# EAGLE schematic arcs-ecu_rev1 (EAGLE 9.0.0)
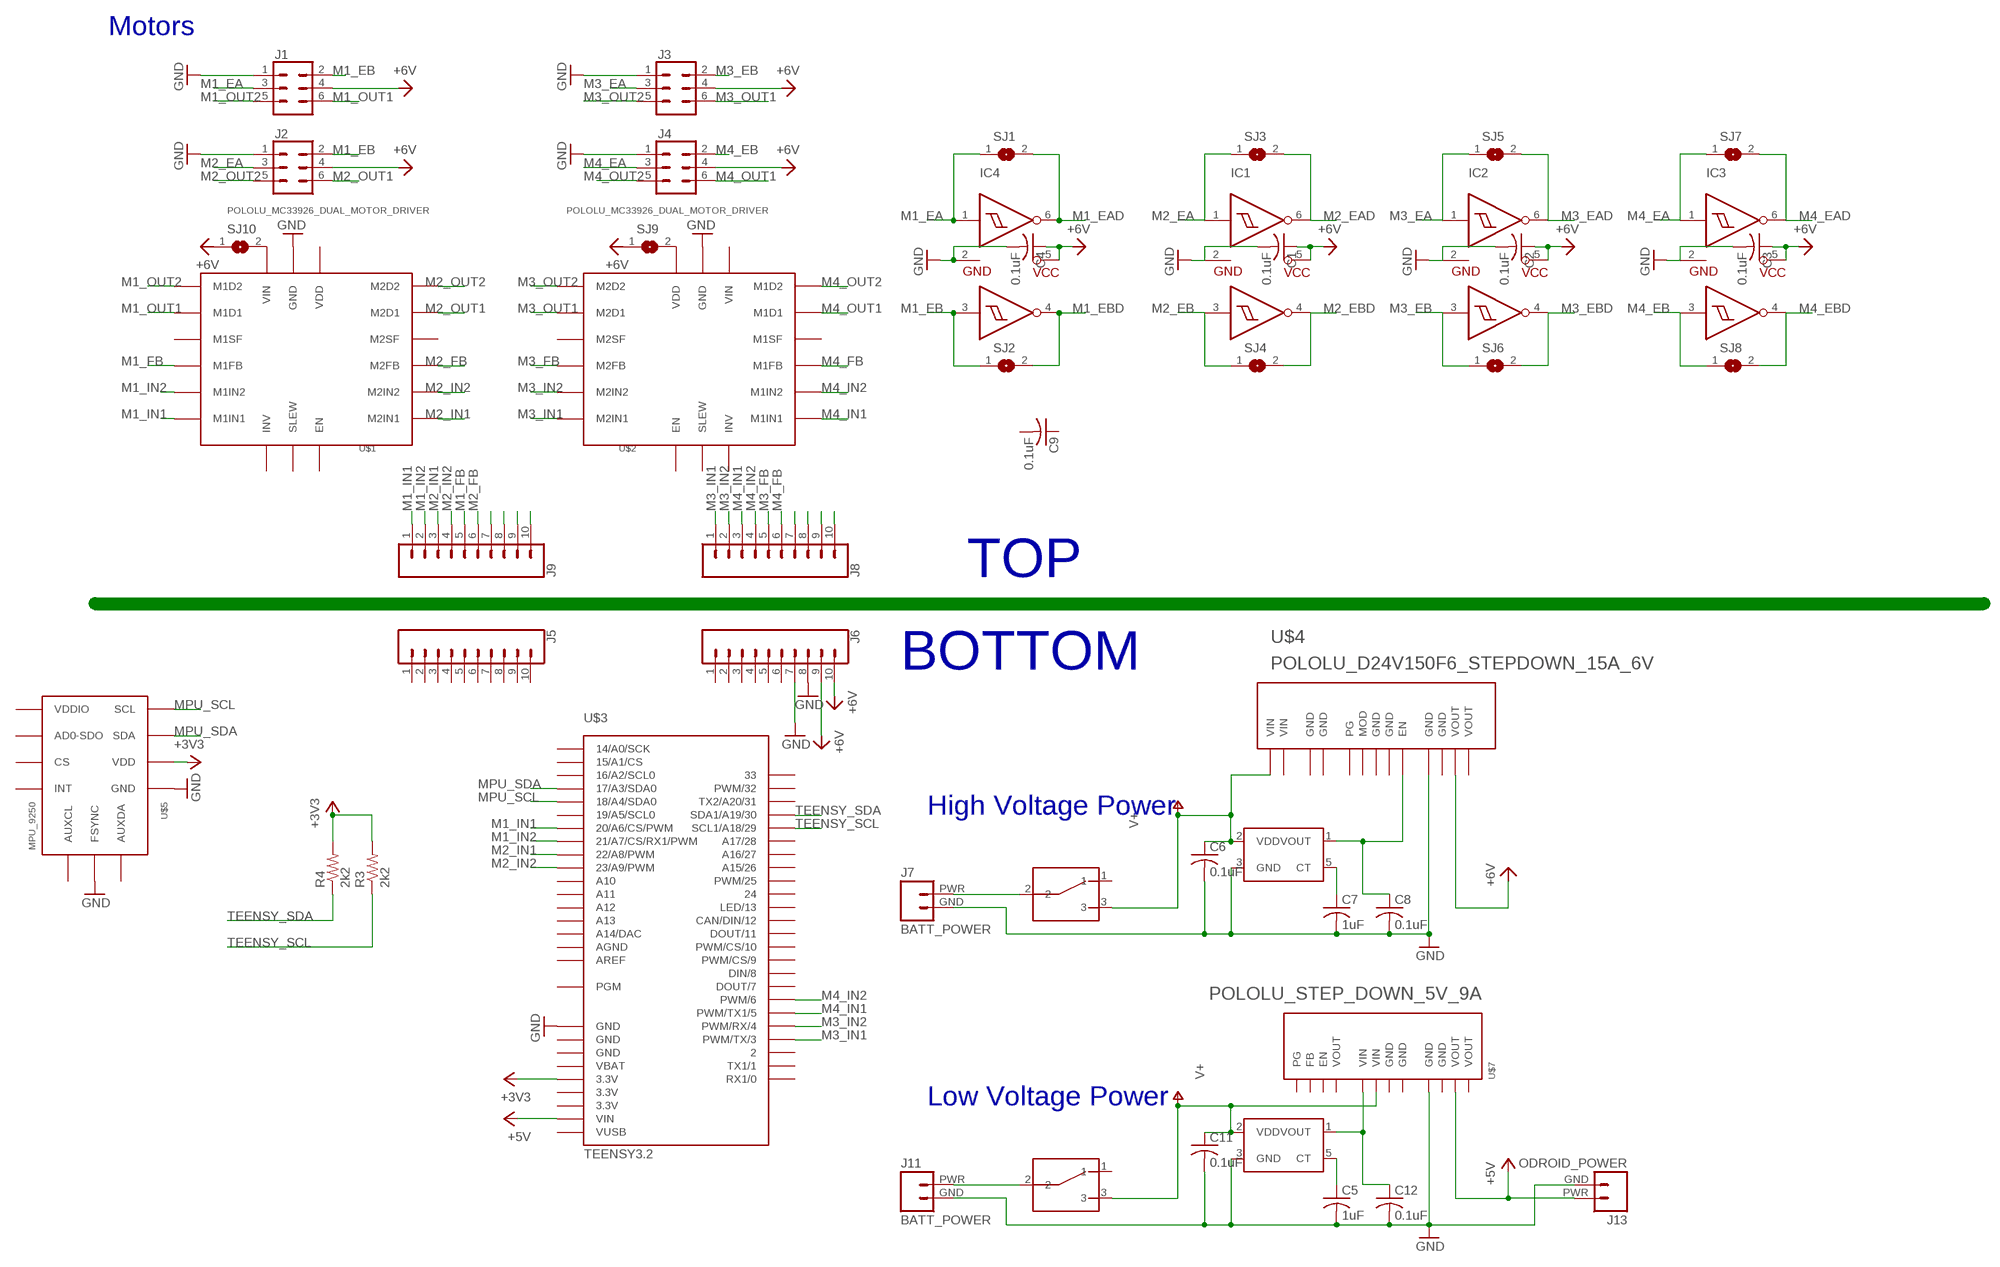
[diagram p0: schematic, sheet 1]

## Parts
C1  0.1uF  C-USC1206  [C1206]
C2  0.1uF  C-USC1206  [C1206]
C3  0.1uF  C-USC1206  [C1206]
C4  0.1uF  C-USC1206  [C1206]
C5  1uF  C-USC1206  [C1206]
C6  0.1uF  C-USC1206  [C1206]
C7  1uF  C-USC1206  [C1206]
C8  0.1uF  C-USC1206  [C1206]
C9  0.1uF  C-USC1206  [C1206]
C11  0.1uF  C-USC1206  [C1206]
C12  0.1uF  C-USC1206  [C1206]
IC1  SN74AUP2G17  [SC-70-6]
IC2  SN74AUP2G17  [SC-70-6]
IC3  SN74AUP2G17  [SC-70-6]
IC4  SN74AUP2G17  [SC-70-6]
J1  CONN_03X2SHROUD  [2X3-SHROUDED]
J2  CONN_03X2SHROUD  [2X3-SHROUDED]
J3  CONN_03X2SHROUD  [2X3-SHROUDED]
J4  CONN_03X2SHROUD  [2X3-SHROUDED]
J5  CONN_10"  [1X10]
J6  CONN_10"  [1X10]
J7  BATT_POWER  [BATT_POWER]
J8  CONN_10"  [1X10]
J9  CONN_10"  [1X10]
J11  BATT_POWER  [BATT_POWER]
J13  ODROID_POWER  [ODOIRD_PWR]
R3  2k2  R-US_R1206  [R1206]
R4  2k2  R-US_R1206  [R1206]
SJ1  SJ  [SJ]
SJ2  SJ  [SJ]
SJ3  SJ  [SJ]
SJ4  SJ  [SJ]
SJ5  SJ  [SJ]
SJ6  SJ  [SJ]
SJ7  SJ  [SJ]
SJ8  SJ  [SJ]
SJ9  SJ  [SJ]
SJ10  SJ  [SJ]
SW1  500SSP1S1M6QEA  [500SSP1S1M6QEA_SWITCH]
SW3  500SSP1S1M6QEA  [500SSP1S1M6QEA_SWITCH]
U$1  POLOLU_MC33926_DUAL_MOTOR_DRIVER  [POLOLU_MC33926_DUAL_MOTOR_DRIVER]
U$2  POLOLU_MC33926_DUAL_MOTOR_DRIVER  [POLOLU_MC33926_DUAL_MOTOR_DRIVER]
U$3  TEENSY3.2  [TEENSY3.2]
U$4  POLOLU_D24V150F6_STEPDOWN_15A_6V  [POLOLU_D24V150F6_STEPDOWN_15A_6V]
U$5  MPU_9250  [MPU-9250]
U$6  BD5260G  [SOT23-5]
U$7  POLOLU_STEP_DOWN_5V_9A  [POLOLU_STEP_DOWN_5V_9A]
U$9  BD5260G  [SOT23-5]

## Nets
+3V3: R3.2 R4.2 U$3.3.3V@1(3.3V) U$5.VDD
+5V: J13.PWR U$3.VIN U$7.VOUT@2(VOUT)
GND: C5.2 C6.2 C7.2 C8.2 C11.2 C12.2 IC4.2(GND) J1.1 J2.1 J3.1 J4.1 J6.7 J6.8 J7.GND J11.GND J13.GND U$3.GND@1(GND) U$4.GND@3(GND) U$6.3(GND) U$7.GND@3(GND) U$9.3(GND)
M1_EA: IC4.1(1A) J1.3
M1_EAD: IC4.6(1Y)
M1_EB: IC4.3(2A) J1.2 J2.2
M1_EBD: IC4.4(2Y)
M1_FB: U$1.M1FB
M1_IN1: J9.1 U$1.M1IN1 U$3.20/A6(20/A6/CS/PWM)
M1_IN2: J9.2 U$1.M1IN2 U$3.21/A7(21/A7/CS/RX1/PWM)
M1_OUT1: J1.6 U$1.M1D1
M1_OUT2: J1.5 U$1.M1D2
M2_EA: J2.3
M2_FB: U$1.M2FB
M2_IN1: J9.3 U$1.M2IN1 U$3.22/A8(22/A8/PWM)
M2_IN2: J9.4 U$1.M2IN2 U$3.23/A9(23/A9/PWM)
M2_OUT1: J2.6 U$1.M2D1
M2_OUT2: J2.5 U$1.M2D2
M3_EA: J3.3
M3_EB: J3.2
M3_FB: U$2.M2FB
M3_IN1: U$2.M2IN1 U$3.3(PWM/TX/3)
M3_IN2: U$2.M2IN2 U$3.4(PWM/RX/4)
M3_OUT1: J3.6 U$2.M2D1
M3_OUT2: J3.5 U$2.M2D2
M4_EA: J4.3
M4_EB: J4.2
M4_FB: U$2.M1FB
M4_IN1: U$2.M1IN1 U$3.5(PWM/TX1/5)
M4_IN2: U$2.M1IN2 U$3.6(PWM/6)
M4_OUT1: J4.6 U$2.M1D1
M4_OUT2: J4.5 U$2.M1D2
MPU_SCL: U$3.18/A4(18/A4/SDA0) U$5.SCL
MPU_SDA: U$3.17/A3(17/A3/SDA0) U$5.SDA
N$1: J7.PWR SW1.2
N$2: J11.PWR SW3.2
N$3: C8.1 U$4.EN U$6.1(VOUT)
N$4: C7.1 U$6.5(CT)
N$6: SJ10.2 U$1.VIN
N$7: J9.9
N$8: J9.10
N$9: C12.1 U$7.VIN@1(VIN) U$9.1(VOUT)
N$10: C5.1 U$9.5(CT)
N$15: J8.5
N$16: J8.6
N$17: J8.7
N$18: J8.8
N$19: J8.9
N$20: J8.10
N$21: J9.5
N$22: J9.6
N$23: J9.7
N$24: J9.8
P$1: IC4.5(VCC) J1.4 J2.4 J3.4 J4.4 J6.9 J6.10 U$4.VOUT@1(VOUT) ; supply symbol labelled +6V
TEENSY_SCL: R3.1 U$3.29(SCL1/A18/29)
TEENSY_SDA: R4.1 U$3.30(SDA1/A19/30)
V+: C6.1 C11.1 SW1.3 SW3.3 U$4.VIN@1(VIN) U$6.2(VDD) U$7.VIN@2(VIN) U$9.2(VDD)
Unconnected: C1.1 C1.2 C2.1 C2.2 C3.1 C3.2 C4.1 C4.2 C9.1 C9.2 IC1.1(1A) IC1.2(GND) IC1.3(2A) IC1.4(2Y) IC1.5(VCC) IC1.6(1Y) IC2.1(1A) IC2.2(GND) IC2.3(2A) IC2.4(2Y) IC2.5(VCC) IC2.6(1Y) IC3.1(1A) IC3.2(GND) IC3.3(2A) IC3.4(2Y) IC3.5(VCC) IC3.6(1Y) J5.1 J5.2 J5.3 J5.4 J5.5 J5.6 J5.7 J5.8 J5.9 J5.10 J6.1 J6.2 J6.3 J6.4 J6.5 J6.6 J8.1 J8.2 J8.3 J8.4 SJ1.1 SJ1.2 SJ2.1 SJ2.2 SJ3.1 SJ3.2 SJ4.1 SJ4.2 SJ5.1 SJ5.2 SJ6.1 SJ6.2 SJ7.1 SJ7.2 SJ8.1 SJ8.2 SJ9.1 SJ9.2 SJ10.1 SW1.1 SW3.1 U$1.EN U$1.GND U$1.INV U$1.M1SF U$1.MS2F(M2SF) U$1.SLEW U$1.VDD U$2.EN U$2.GND U$2.INV U$2.M1SF U$2.MS2F(M2SF) U$2.SLEW U$2.VDD U$2.VIN U$3.0(RX1/0) U$3.1(TX1/1) U$3.2 U$3.3.3V@2(3.3V) U$3.3.3V@3(3.3V) U$3.7(DOUT/7) U$3.8(DIN/8) U$3.9(PWM/CS/9) U$3.10(PWM/CS/10) U$3.11(DOUT/11) U$3.12(CAN/DIN/12) U$3.13(LED/13) U$3.14/A0(14/A0/SCK) U$3.15/A1(15/A1/CS) U$3.16/A2(16/A2/SCL0) U$3.19/A5(19/A5/SCL0) U$3.24 U$3.25(PWM/25) U$3.26/A15(A15/26) U$3.27/A16(A16/27) U$3.28/A17(A17/28) U$3.31(TX2/A20/31) U$3.32(PWM/32) U$3.33 U$3.A10 U$3.A11 U$3.A12 U$3.A13 U$3.A14(A14/DAC) U$3.AGND U$3.AREF U$3.GND@2(GND) U$3.GND@3(GND) U$3.PGM U$3.VBAT U$3.VUSB U$4.GND@1(GND) U$4.GND@2(GND) U$4.GND@4(GND) U$4.GND@5(GND) U$4.GND@6(GND) U$4.MOD U$4.PG U$4.VIN@2(VIN) U$4.VOUT@2(VOUT) U$5.AD0/SDO(AD0-SDO) U$5.AUXCL U$5.AUXDA U$5.CS U$5.FSYNC U$5.GND U$5.INT U$5.VDDIO U$7.EN U$7.FB U$7.GND@1(GND) U$7.GND@2(GND) U$7.GND@4(GND) U$7.PG U$7.VOUT@1(VOUT) U$7.VOUT@3(VOUT)

## Notes on the sheet
- Motors
- TOP
- BOTTOM
- High Voltage Power
- Low Voltage Power

## Library data of the parts
C1-C9 C11 C12 = rcl:C-US: CAPACITOR, American symbol; SPICEPREFIX: C
IC1-IC4 = arcs_library:SN74AUP2G17
J1-J4 = SparkFun-Connectors:CONN_03X2: Multi connection point. Often used as Generic Header-pin footprint for 0.1 inch spaced/style header connections You can populate with any combo of single row headers, but if you'd like an exact match, check these: Header - 2x3 (Male, 0.1") <https://www.sparkfun.com/products/12807> (PRT-12807) Header - 2x3 (Female, 0.1") <https://www.sparkfun.com/products/13010> (PRT-13010) 2x3 Pin Shrouded Header <https://www.sparkfun.com/products/10877> (PRT-10877) On any of the 0.1 inch spaced packages, you can populate with these: Break Away Headers - Straight <https://www.sparkfun.com/products/116> (PRT-00116) Break Away Male Headers - Right Angle <https://www.sparkfun.com/products/553> (PRT-00553) Female Headers <https://www.sparkfun.com/products/115> (PRT-00115) Break Away Headers - Machine Pin <https://www.sparkfun.com/products/117> (PRT-00117) Break Away Female Headers - Swiss Machine Pin <https://www.sparkfun.com/products/743> (PRT-00743) Special note: the shrouded connector mates well with our 3x2 ribbon cables: Ribbon Crimp Connector - 6-pin (2x3, Female) <https://www.sparkfun.com/products/10651> (PRT-10651) Ribbon Cable - 6 wire (15ft) <https://www.sparkfun.com/products/10646> (PRT-10646); PROD_ID: CONN-10681; SF_ID: PRT_10877
J5 J6 J8 J9 = SparkFun-Connectors:CONN_10: Multi connection point. Often used as Generic Header-pin footprint for 0.1 inch spaced/style header connections On any of the 0.1 inch spaced packages, you can populate with these: Break Away Headers - Straight <https://www.sparkfun.com/products/116> (PRT-00116) Break Away Male Headers - Right Angle <https://www.sparkfun.com/products/553> (PRT-00553) Female Headers <https://www.sparkfun.com/products/115> (PRT-00115) Break Away Headers - Machine Pin <https://www.sparkfun.com/products/117> (PRT-00117) Break Away Female Headers - Swiss Machine Pin <https://www.sparkfun.com/products/743> (PRT-00743) Arduino Stackable Header - 10 Pin <https://www.sparkfun.com/products/11376> (PRT-11376) For SCREWTERMINALS and SPRING TERMINALS visit here: Screw Terimnals on SparkFun.com <https://www.sparkfun.com/search/results?term=Screw+Terminals> (5mm/3.5mm/2.54mm spacing) This device is also useful as a general connection point to wire up your design to another part of your project. Our various solder wires solder well into these plated through hole pads. Hook-Up Wire - Assortment (Stranded, 22 AWG) <https://www.sparkfun.com/products/11375> (PRT-11375) Hook-Up Wire - Assortment (Solid Core, 22 AWG) <https://www.sparkfun.com/products/11367> (PRT-11367) View the entire wire category on our website here <https://www.sparkfun.com/categories/141> Special notes: Molex polarized connector foot print use with SKU : PRT-08231 with associated crimp pins and housings. 1MM SMD Version SKU: PRT-10208 NOTES ON THE VARIANTS LOCK and LOCK_LONGPADS... This footprint was designed to help hold the alignment of a through-hole component (i.e. 6-pin header) while soldering it into place. You may notice that each hole has been shifted either up or down by 0.005 of an inch from it's more standard position (which is a perfectly straight line). This slight alteration caused the pins (the squares in the middle) to touch the edges of the holes. Because they are alternating, it causes a "brace" to hold the component in place. 0.005 has proven to be the perfect amount of "off-center" position when using our standard breakaway headers. Although looks a little odd when you look at the bare footprint, once you have a header in there, the alteration is very hard to notice. Also,if you push a header all the way into place, it is covered up entirely on the bottom side.; PROD_ID: CONN-11563
J7 J11 = arcs_library:BATT_POWER
J13 = arcs_library:ODROID_POWER
R3 R4 = resistor:R-US_: RESISTOR, American symbol
SJ1-SJ10 = jumper:SJ: SMD solder JUMPER
SW1 SW3 = arcs_library:500SSP1S1M6QEA
U$1 U$2 = arcs_library:POLOLU_MC33926_DUAL_MOTOR_DRIVER
U$3 = arcs_library:TEENSY3.2
U$4 = arcs_library:POLOLU_D24V150F6_STEPDOWN_15A_6V
U$5 = arcs_library:MPU_9250
U$6 U$9 = arcs_library:BD5260G
U$7 = arcs_library:POLOLU_STEP_DOWN_5V_9A